# EAGLE schematic t6713_v_1_0 (EAGLE 8.4.2)
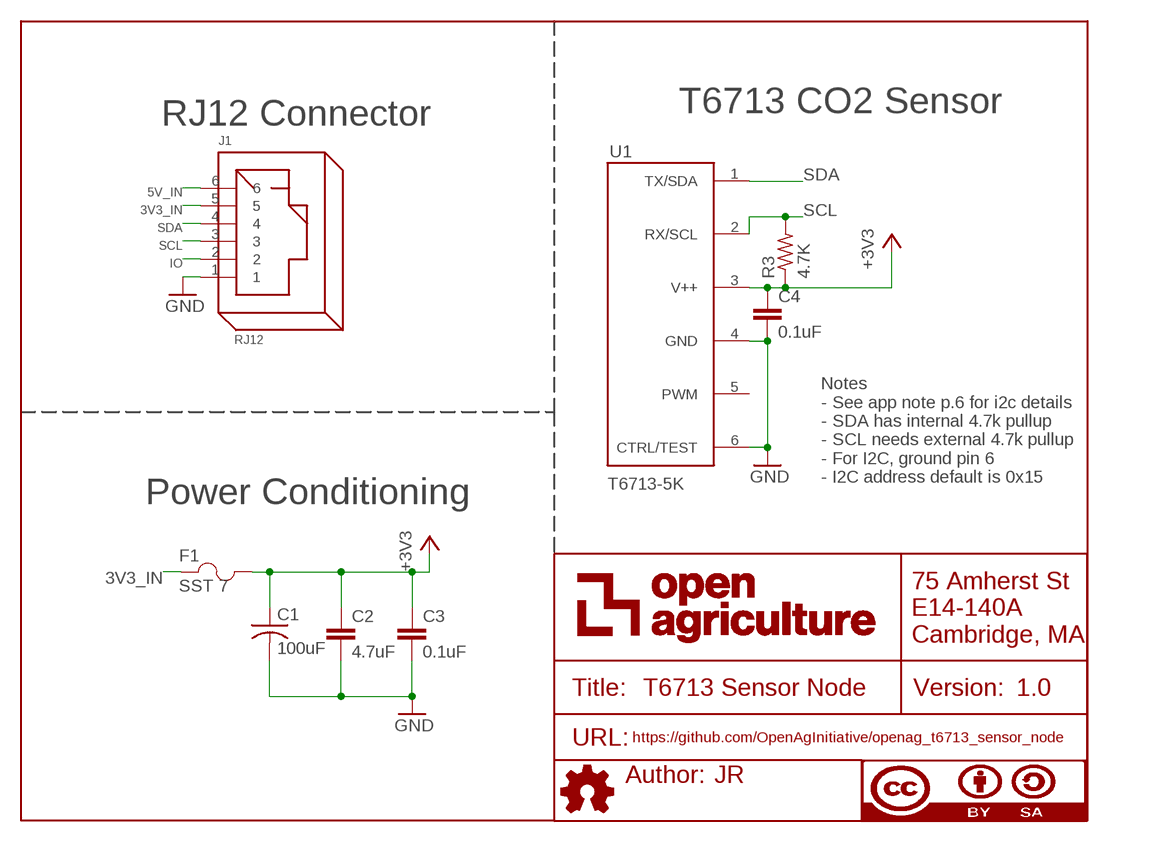
[diagram p0: schematic, sheet 1]

## Parts
C1  100uF  100UF-EEE-1HA101UP  [EEE-1HA101UP]
C2  4.7uF  4.7UF-CL21A475KBQNNNE  [C0805]
C3  0.1uF  0.1UF-C0603C104K5RACTU  [C0603]
C4  0.1uF  0.1UF-C0603C104K5RACTU  [C0603]
F1  SST 7  SST_7  [SS]
FRAME1  DOCFIELD  [DOCFIELD]
J1  RJ12  A-2004-1-4-LP-N-R  [RJ12]
R3  4.7K  4.7K-RC1206JR-074K7L  [R1206]
U1  T6713-5K  [T6713]

## Nets
3V3_IN: F1.1 J1.5
5V_IN: J1.6
+3V3: C1.+(1(+)) C2.1 C3.1 C4.1 F1.2 R3.1 U1.3(V++)
GND: C1.-(2(-)) C2.2 C3.2 C4.2 J1.1 U1.4(GND) U1.6(CTRL/TEST)
IO: J1.2
SCL: J1.3 R3.2 U1.2(RX/SCL)
SDA: J1.4 U1.1(TX/SDA)
Unconnected: U1.5(PWM)

## Notes on the sheet
- T6713 CO2 Sensor
- RJ12 Connector
- Notes
  - See app note p.6 for i2c details
  - SDA has internal 4.7k pullup
  - SCL needs external 4.7k pullup
  - For I2C, ground pin 6
  - I2C address default is 0x15
- Power Conditioning

## Library data of the parts
C1 = openag-capacitors:100UF-EEE-1HA101UP: Panasonic - EEE-1HA101UP - ELECTROLYTIC CAP ALUM 100UF 20% 50V SMD Description: 100µF 50V Aluminum Electrolytic Capacitors Radial, Can - SMD 2000 Hrs @ 85°C Technical Specifications: Capacitance: 100uF Tolerance: ±20% Rated Voltage: 50V Polarization: Polar Operating Temperature: -40°C ~ 85°C Datasheet(s): S Series, Type V <https://industrial.panasonic.com/cdbs/www-data/pdf/RDE0000/ABA0000C1145.pdf> Vendor(s): Digikey: PCE3917CT-ND <https://www.digikey.com/product-detail/en/panasonic-electronic-components/EEE-1HA101UP/PCE3917CT-ND/766293>; POPULATE: YES; VERIFIED: NO
C2 = openag-capacitors:4.7UF-CL21A475KBQNNNE: Samsung - CL21A475KBQNNNE - CAP CER 4.7UF 50V X5R 0805 Description: 4.7µF ±10% 50V Ceramic Capacitor X5R 0805 (2012 Metric) Technical Specifications: Capacitance: 4.7uF Tolerance: ±10% Rated Voltage: 50V Temperature Coefficient: X5R Operating Temperature: -55°C ~ 85°C Package/Case: 0805 (2012 Metric) Datasheet(s): CL21A475KBQNNNE Characteristics <http://www.samsungsem.com/kr/front/downloadcms.do?path=/kr/support/product-search/mlcc/__icsFiles/afieldfile/2014/11/05&fileName=C_CL21A475KBQNNNE.pdf> Vendor(s): Digikey: 1276-1248-1-ND <https://www.digikey.com/product-detail/en/samsung-electro-mechanics/CL21A475KBQNNNE/1276-1248-1-ND/3889334>; POPULATE: YES; VERIFIED: NO
C3 C4 = openag-capacitors:0.1UF-C0603C104K5RACTU: Kemet - C0603C104K5RACTU - CAP CER 0.1UF 50V X7R 0603 Description: 0.1µF ±10% 50V Ceramic Capacitor X7R 0603 (1608 Metric) Technical Specifications: Capacitance: 0.1µF Tolerance: ±10% Rated Voltage: 50V Temperature Coefficient: X7R Operating Temperature: -55°C ~ 125°C Package / Case: 0603 (1608 Metric) Datasheet(s): X7R Dielectric, 6.3-250 VDC <https://search.kemet.com/component-edge/download/datasheet/C0603C104K5RACTU.pdf> Vendor(s): Digikey: 399-5089-1-ND <https://www.digikey.com/product-detail/en/kemet/C0603C104K5RACTU/399-5089-1-ND/1465623>; POPULATE: YES; VERIFIED: NO
F1 = openag-fuses:SST_7: Bel Fuse - SST7 - FUSE BRD MNT 7A 125VAC/VDC 2SMD Description: FUSE BRD MNT 7A 125VAC/VDC 2SMD Technical Specifications: Current Rating: 7A Voltage Rating: 125V Fuse Type: Board Mount (Cartridge Style Excluded) Mounting Type: Surface Mount Operating Temperature: -55°C ~ 125°C Datasheet(s): SST Type <https://belfuse.com/resources/StewartConnector/SST.pdf> Vendor(s): Digikey: 507-1072-1-ND <https://www.digikey.com/product-detail/en/bel-fuse-inc/SST-7/507-1072-1-ND/615026>; POPULATE: YES; VERIFIED: NO
FRAME1 = openag-frames:DOCFIELD: DOCUMENT FIELD; AUTHOR: JR; TITLE: T6713 Sensor Node; URL: https://github.com/OpenAgInitiative/openag_t6713_sensor_node; VER: 1.0
J1 = openag-connectors:A-2004-1-4-LP-N-R: Assmann WSW Components - A-2004-1-4-LP-N-R - CONN MOD JACK 6P6C R/A UNSHLD Description: Jack Modular Connector 6p6c (RJ11, RJ12, RJ14, RJ25) 90° Angle (Right) Unshielded Technical Specifications: Connector Type: Jack Number of Positions/Contacts: 6p6c (RJ11, RJ12, RJ14, RJ25) Number of Ports: 1 Number of Rows: 1 Mounting Type: Through Hole Orientation: 90° Angle (Right) Termination: Solder Shielding: Unshielded Features: Board Lock LED Color: Does Not Contain LED Tab Direction: Down Contact Material: Phosphor Bronze Contact Finish: Gold Contact Finish Thickness: 6µin (0.152µm) Housing Material: Polybutylene Terephthalate (PBT), Glass Filled Operating Temperature: -40°C ~ 85°C Datasheet(s): A-2004-1-4-LP-N Drawing <http://www.assmann-wsw.com/fileadmin/datasheets/ASS_7320_CO.pdf> Vendor(s): Digikey: AE10383-ND <https://www.digikey.com/product-detail/en/assmann-wsw-components/A-2004-1-4-LP-N-R/AE10383-ND/2183634>; POPULATE: YES; VERIFIED: NO
R3 = openag-resistors:4.7K-RC1206JR-074K7L: Yageo - RC1206JR-074K7L - RES SMD 4.7K OHM 5% 1/4W 1206 Description: 4.7 kOhms ±5% 0.25W, 1/4W Chip Resistor 1206 (3216 Metric) Moisture Resistant Thick Film Technical Specifications: Resistance: 4.7 kOhms Tolerance: ±5% Power (Watts): 0.25W, 1/4W Composition: Thick Film Features: Moisture Resistant Temperature Coefficient: ±100ppm/°C Operating Temperature: -55°C ~ 155°C Package / Case: 1206 (3216 Metric) Supplier Device Package: 1206 Size / Dimension: 0.122" L x 0.063" W (3.10mm x 1.60mm) Height - Seated (Max): 0.026" (0.65mm) Number of Terminations: 2 Datasheet(s): Thick Film Chip Resistor Intro <http://www.yageo.com.tw/exep/pages/download/literatures/PYu-R_INT-thick_7.pdf> Chip Resistor Marking <http://www.yageo.com/exep/pages/download/literatures/PYu-R_Marking_2.pdf> RC Series, L Datasheet <http://www.yageo.com/documents/recent/PYu-RC_Group_51_RoHS_L_8.pdf> Vendor(s): Digikey: 311-4.7KERCT-ND <https://www.digikey.com/product-detail/en/yageo/RC1206JR-074K7L/311-4.7KERCT-ND/732242>; POPULATE: YES; VERIFIED: NO
U1 = openag-sensors:T6713-5K: Amphenol Advanced Sensors - T6713-5K - CO2 MODULE 5000PPM DIFFUSION Description: CO2 Sensor I²C Technical Specifications: Type: CO2 Accuracy: ±2% Output: I²C Operating Temperature: 14 ~ 140°F (-10 ~ 60°C) Voltage - Supply: 4.5 V ~ 5.5 V Current - Supply: 200mA Datasheet(s): T6713 Series Datasheet <http://www.amphenol-sensors.com/en/component/edocman/297-telaire-t6713-series-datasheet/download?Itemid=591> Telaire CO2 Module Selection Guide <http://www.amphenol-sensors.com/en/component/edocman/488-telaire-co2-module-selection-guide-single-or-dual-channel/download?Itemid=591> T67xx Appl Note <http://www.amphenol-sensors.com/en/component/edocman/332-telaire-6700-series-application-note/download?Itemid=591> Vendor(s): Digikey: 235-1374-ND <https://www.digikey.com/products/en?keywords=235-1374>; POPULATE: YES; VERIFIED: NO